# Altium schematic sheet AVR-programming-cable.SchDoc: LittleWireAVR
size OrCAD A; ApprovedBy: DMH; CheckedBy: DMH; Author: DMH; CompanyName: Detex Corp; DrawnBy: DMH; Engineer: DMH; Organization: Detex Corp; Address1: 302 Detex Dr; Address2: New Braunfels, TX 78130; Revision: 1.0.0; SheetNumber: 1; SheetTotal: 1; =VersionControl_RevNumber: 1.0.0; DocumentName: LittleWireAVR
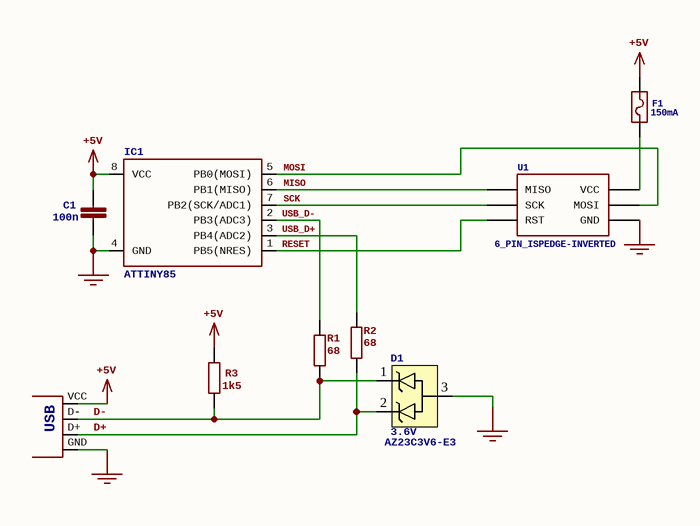
[diagram p0: AVR-programming-cable.SchDoc]

## Parts
C1  100n  [RESC0805(2012)_M]
D1  3.6V  MPN: AZ23C3V6-E3  [SOT23_M]
F1  150mA  [SMD-0805]
IC1  ATTINY85  [8P3]
R1  68  [RESC0805(2012)_M]
R2  68  [RESC0805(2012)_M]
R3  1k5  [RESC0805(2012)_M]
U1  6_PIN_ISPEDGE-INVERTED  [6_PIN_EDGE]
U$2  USB2.5-2.0-2.5  [USB-FEMALE-A]  (value not drawn)

## Nets
+5V: C1.1 F1.2(P$2) IC1.8(VCC) R3.2 U$2.VCC(VBUS)
GND: C1.2 D1.3 IC1.4(GND) U1.5(GND) U$2.GND
D+: D1.2 R2.1 U$2.D+
D-: D1.1 R1.1 R3.1 U$2.D-
MISO: IC1.6(PB1(MISO)) U1.2(MISO)
MOSI: IC1.5(PB0(MOSI)) U1.3(MOSI)
RESET: IC1.1(PB5(NRES)) U1.6(RST)
SCK: IC1.7(PB2(SCK/ADC1)) U1.4(SCK)
USB_D+: IC1.3(PB4(ADC2)) R2.2
USB_D-: IC1.2(PB3(ADC3)) R1.2
NetF1_1: F1.1(P$1) U1.1(VCC)

## Notes on the sheet
- Project:
- Approved By:
- Date:
- Test
- DMH
- Number:
- Time:
- Revision:
- Sheet
- of
- 2
- 302 Detex Drive
- New Braunfels, TX 78130
- (830) 629-2900
- File Name:

## Library data of the parts
C1 = C-EUC0603: CAPACITOR, European symbol
D1 = DUAL_ZENER: 3.6V Zener Diode, Dual Common Anode; Manufacturer: Vishay Semi; Package: SOT-23
F1 = FUSE0805
IC1 = ATTINY45: Atmel ATTiny45
R1-R3 = R-EU_R0603: RESISTOR, European symbol
U1 = 6_PIN_ISPEDGE-INVERTED: AVR 6 PIN ISP header Edge connector normal layout
U$2 = USB2.5-2.0-2.5: USB: USB